# EAGLE design quantum_PSU_V2_3 (EAGLE 9.6.2)
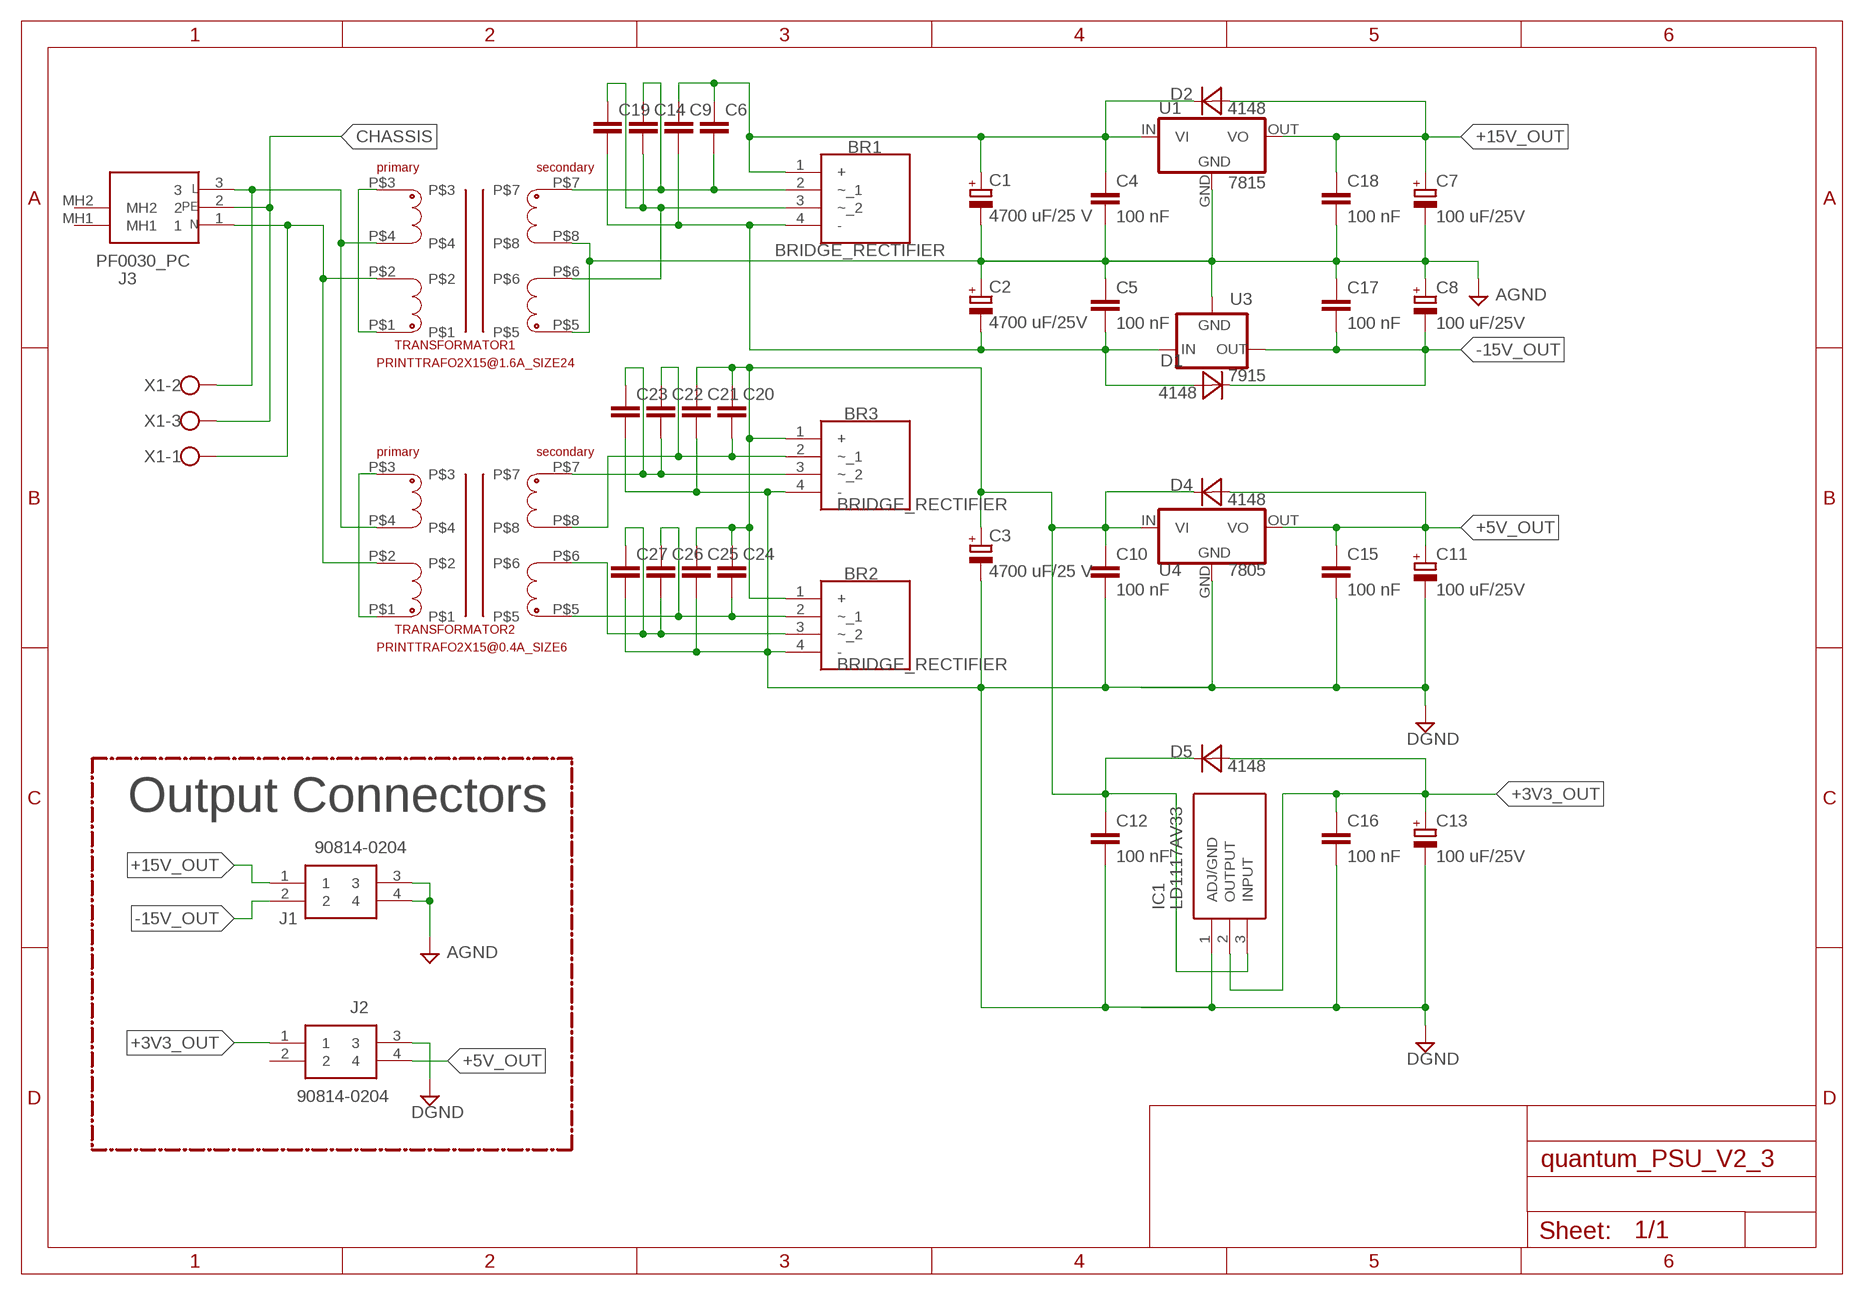
[diagram p0: schematic, sheet 1]

## Parts
BR1  BRIDGE_RECTIFIER  [KBP308G]
BR2  BRIDGE_RECTIFIER  [KBP308G]
BR3  BRIDGE_RECTIFIER  [KBP308G]
C1  4700 uF/25 V  CAPACITOR_ELECTROLYTIC_16MM-THT  [ELECTROLYTIC_16MM]
C2  4700 uF/25V  CAPACITOR_ELECTROLYTIC_16MM-THT  [ELECTROLYTIC_16MM]
C3  4700 uF/25 V  CAPACITOR_ELECTROLYTIC_16MM-THT  [ELECTROLYTIC_16MM]
C4  100 nF  CAPACITOR_5MM  [C5MM]
C5  100 nF  CAPACITOR_5MM  [C5MM]
C6  CAPACITOR_2.5MM  [C2.5MM]
C7  100 uF/25V  CAPACITOR_ELECTROLYTIC_8MM-THT  [ELECTROLYTIC_8MM]
C8  100 uF/25V  CAPACITOR_ELECTROLYTIC_8MM-THT  [ELECTROLYTIC_8MM]
C9  CAPACITOR_2.5MM  [C2.5MM]
C10  100 nF  CAPACITOR_5MM  [C5MM]
C11  100 uF/25V  CAPACITOR_ELECTROLYTIC_8MM-THT  [ELECTROLYTIC_8MM]
C12  100 nF  CAPACITOR_5MM  [C5MM]
C13  100 uF/25V  CAPACITOR_ELECTROLYTIC_8MM-THT  [ELECTROLYTIC_8MM]
C14  CAPACITOR_2.5MM  [C2.5MM]
C15  100 nF  CAPACITOR_5MM  [C5MM]
C16  100 nF  CAPACITOR_5MM  [C5MM]
C17  100 nF  CAPACITOR_5MM  [C5MM]
C18  100 nF  CAPACITOR_5MM  [C5MM]
C19  CAPACITOR_2.5MM  [C2.5MM]
C20  CAPACITOR_2.5MM  [C2.5MM]
C21  CAPACITOR_2.5MM  [C2.5MM]
C22  CAPACITOR_2.5MM  [C2.5MM]
C23  CAPACITOR_2.5MM  [C2.5MM]
C24  CAPACITOR_2.5MM  [C2.5MM]
C25  CAPACITOR_2.5MM  [C2.5MM]
C26  CAPACITOR_2.5MM  [C2.5MM]
C27  CAPACITOR_2.5MM  [C2.5MM]
D1  4148  DIODE_4148_THT  [DIODE_THT_STANDING]
D2  4148  DIODE_4148_THT  [DIODE_THT_STANDING]
D4  4148  DIODE_4148_THT  [DIODE_THT_STANDING]
D5  4148  DIODE_4148_THT  [DIODE_THT_STANDING]
IC1  LD1117AV33  [TO255P460X1020X2008-3P]
J1  90814-0204  [MOLEX_90814-0204]
J2  90814-0204  [MOLEX_90814-0204]
J3  PF0030_PC  [PF0030PC]
TRANSFORMATOR1  PRINTTRAFO2X15@1.6A_SIZE24  [LP_SIZE_24]
TRANSFORMATOR2  PRINTTRAFO2X15@0.4A_SIZE6  [LP_SIZE_6]
U1  7815  78_THT  [78XXS_]
U3  7915  79_THT  [79XXS]
U4  7805  78_THT  [78XXS_]
X1  CONNECTOR_3POL  [W237-103]

## Nets
+3V3_OUT: C13.+ C16.1 D5.A IC1.2(OUTPUT) J2.1
+5V_OUT: C11.+ C15.1 D4.A J2.4 U4.OUT(VO)
+15V_OUT: C7.+ C18.1 D2.A J1.1 U1.OUT(VO)
-15V_OUT: C8.- C17.2 D1.C J1.2 U3.OUT
AGND: C1.- C2.+ C4.2 C5.1 C7.- C8.+ C17.1 C18.2 J1.3 J1.4 TRANSFORMATOR1.P$5 TRANSFORMATOR1.P$8 U1.GND U3.GND
CHASSIS: J3.2 X1.3
DGND: BR2.4(-) BR3.4(-) C3.- C10.2 C11.- C12.2 C13.- C15.2 C16.2 C21.2 C23.2 C25.2 C27.2 IC1.1(ADJ/GND) J2.3 U4.GND
N$1: BR3.3(~_2) C22.2 C23.1 TRANSFORMATOR2.P$7
N$2: TRANSFORMATOR2.P$1 TRANSFORMATOR2.P$3
N$3: BR1.3(~_2) C14.2 C19.1 TRANSFORMATOR1.P$6
N$4: TRANSFORMATOR1.P$1 TRANSFORMATOR1.P$3
N$6: BR3.2(~_1) C20.2 C22.1 TRANSFORMATOR2.P$8
N$7: BR2.3(~_2) C26.2 C27.1 TRANSFORMATOR2.P$6
N$8: J3.3 TRANSFORMATOR1.P$4 TRANSFORMATOR2.P$4 X1.2
N$9: J3.1 TRANSFORMATOR1.P$2 TRANSFORMATOR2.P$2 X1.1
N$10: BR2.1(+) BR3.1(+) C3.+ C10.1 C12.1 C20.1 C21.1 C24.1 C25.1 D4.C D5.C IC1.3(INPUT) U4.IN(VI)
N$11: BR1.2(~_1) C6.2 C14.1 TRANSFORMATOR1.P$7
N$12: BR2.2(~_1) C24.2 C26.1 TRANSFORMATOR2.P$5
N$15: BR1.1(+) C1.+ C4.1 C6.1 C9.1 D2.C U1.IN(VI)
N$17: BR1.4(-) C2.- C5.2 C9.2 C19.2 D1.A U3.IN
Unconnected: J2.2 J3.MH1 J3.MH2

## Notes on the sheet
- Output Connectors

## Library data of the parts
BR1-BR3 = passive components:BRIDGE_RECTIFIER: Bridge Rectifiers Bridge Rectifier KBP Source: Datasheet <https://componentsearchengine.com/Datasheets/1/KBP308G.pdf>; DESCRIPTION: Bridge Rectifiers Bridge Rectifier KBP; HEIGHT: 3mm; MANUFACTURER_NAME: Diodes Inc.; MANUFACTURER_PART_NUMBER: KBP308G; MOUSER_PART_NUMBER: 621-KBP308G; MOUSER_PRICE-STOCK: https://www.mouser.com/Search/Refine.aspx?Keyword=621-KBP308G
C1-C3 C7 C8 C11 C13 = passive components:CAPACITOR_ELECTROLYTIC: Electrolytic Capacitor SMD
C4-C6 C9 C10 C12 C14-C27 = passive components:CAPACITOR: ceramic capacitor
D1 D2 D4 D5 = passive components:DIODE: Standard 4148 Diode SOD323 Format; MOUSER_PART_NUMBER: ...
IC1 = passive components:LD1117AV33: LD1117AV33, Low Dropout Voltage Regulator, 1.2A, 3.3 V +/-2%, 3-Pin TO-220 Source: Datasheet <http://www.st.com/web/en/resource/technical/document/datasheet/CD00002116.pdf>; DESCRIPTION: LD1117AV33, Low Dropout Voltage Regulator, 1.2A, 3.3 V +/-2%, 3-Pin TO-220; HEIGHT: 4.6mm; MANUFACTURER_NAME: STMicroelectronics; MANUFACTURER_PART_NUMBER: LD1117AV33; MOUSER_PART_NUMBER: 511-LD1117AV33; MOUSER_PRICE-STOCK: https://www.mouser.co.uk/ProductDetail/STMicroelectronics/LD1117AV33?qs=hUhhBvpTJN9Rfx8G8TXH1A%3D%3D
J1 J2 = electro_mechanical:90814-0204: CONN HEADER 4POS 1.27MM SMD TIN Source: Datasheet <https://componentsearchengine.com/Datasheets/1/90814-0204.pdf>; DESCRIPTION: CONN HEADER 4POS 1.27MM SMD TIN; HEIGHT: mm; MANUFACTURER_NAME: Molex; MANUFACTURER_PART_NUMBER: 90814-0204; MOUSER_PART_NUMBER: 538-90814-0204; MOUSER_PRICE-STOCK: https://www.mouser.com/Search/Refine.aspx?Keyword=538-90814-0204
J3 = electro_mechanical:PF0030_PC: Bulgin C14 Right Angle Through Hole IEC Plug Male, 10A, 250 V ac Source: Datasheet <https://componentsearchengine.com/Datasheets/1/PF0030_PC.pdf>; DESCRIPTION: Bulgin C14 Right Angle Through Hole IEC Plug Male, 10A, 250 V ac; HEIGHT: 35.8mm; MANUFACTURER_NAME: Bulgin; MANUFACTURER_PART_NUMBER: PF0030/PC; MOUSER_PART_NUMBER: 161-PF0030/PC; MOUSER_PRICE-STOCK: https://www.mouser.com/Search/Refine.aspx?Keyword=161-PF0030%2FPC
TRANSFORMATOR1 = passive components:PRINTTRAFO: Printtrafo several siyes availlable; MOUSER_PART_NUMBER: 530-LP-30-800
TRANSFORMATOR2 = passive components:PRINTTRAFO: Printtrafo several siyes availlable; MOUSER_PART_NUMBER: 530-LP-30-200
U1 U4 = passive components:78**
U3 = passive components:79**: VOLTAGE REGULATOR
X1 = electro_mechanical:CONNECTOR: WAGO SCREW CLAMP

## Board
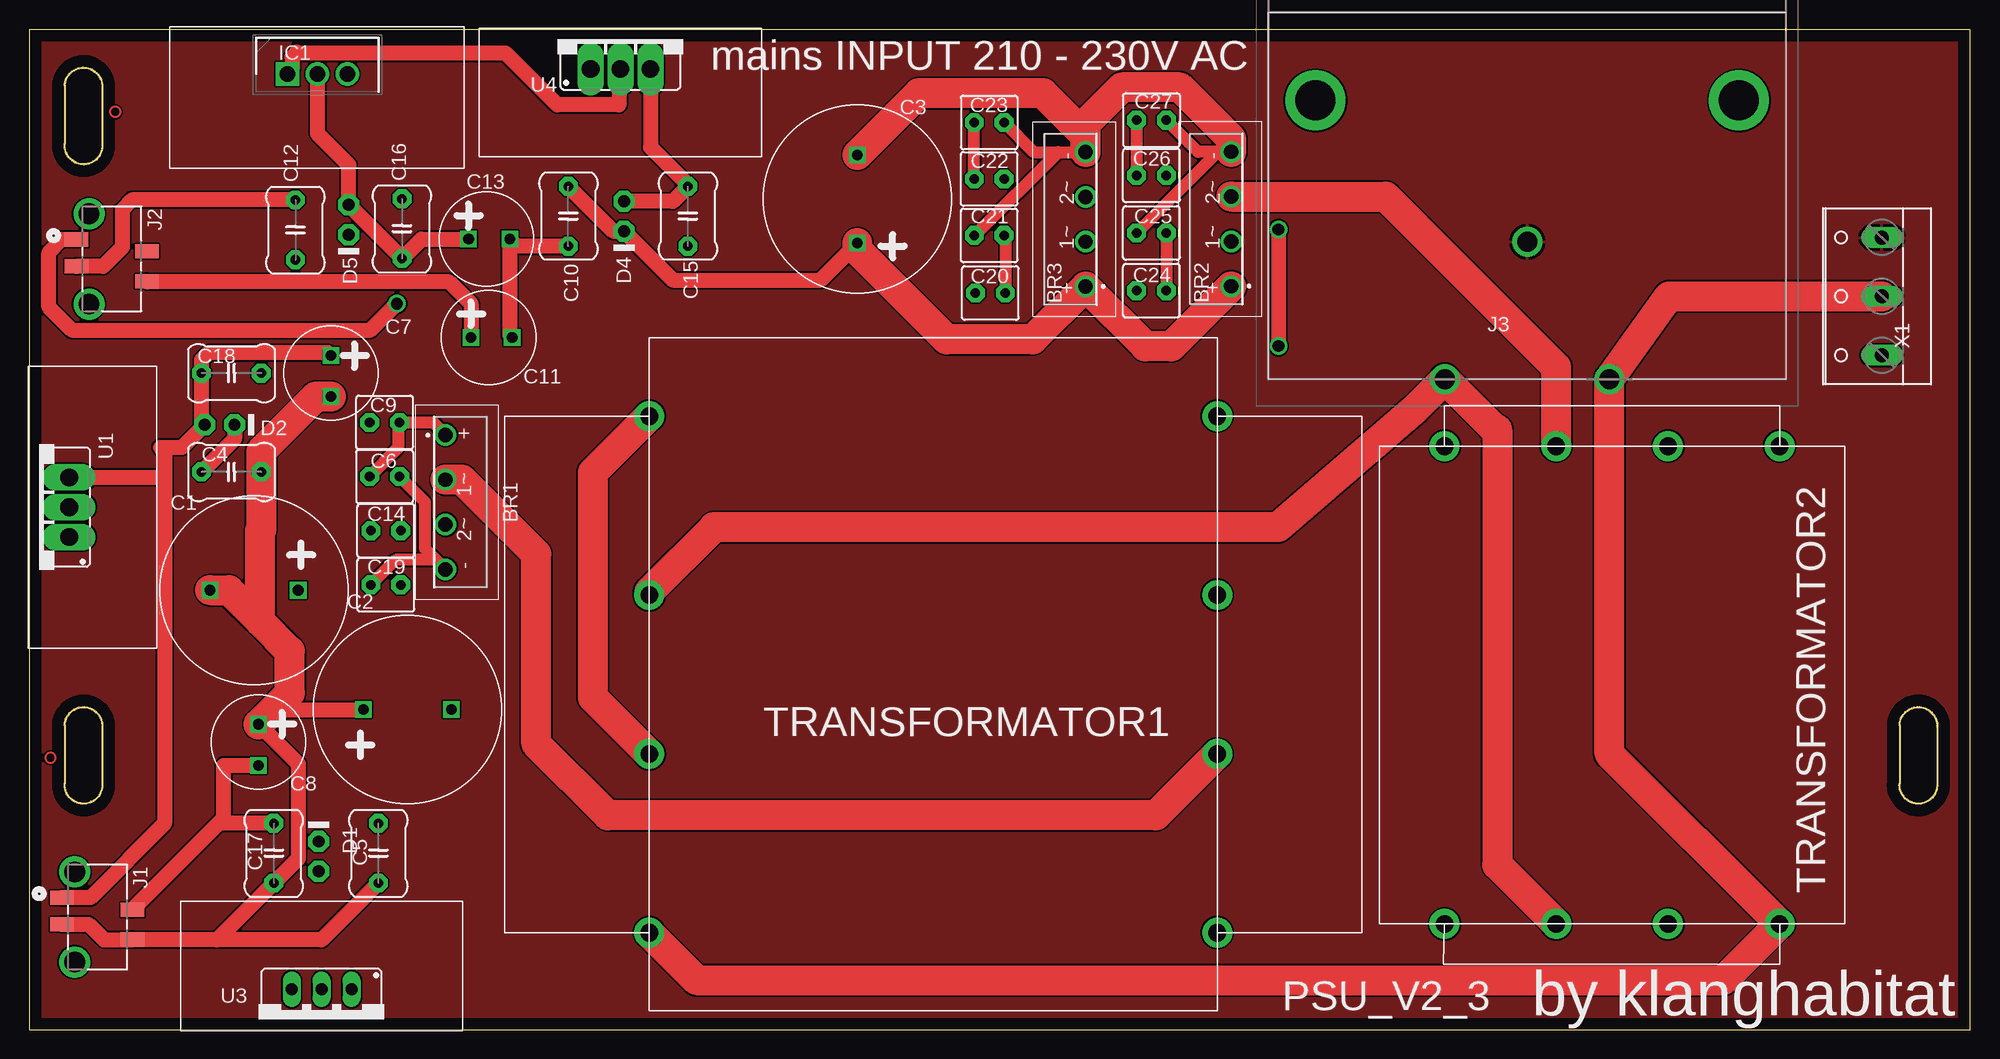
[diagram p1: board, top side]
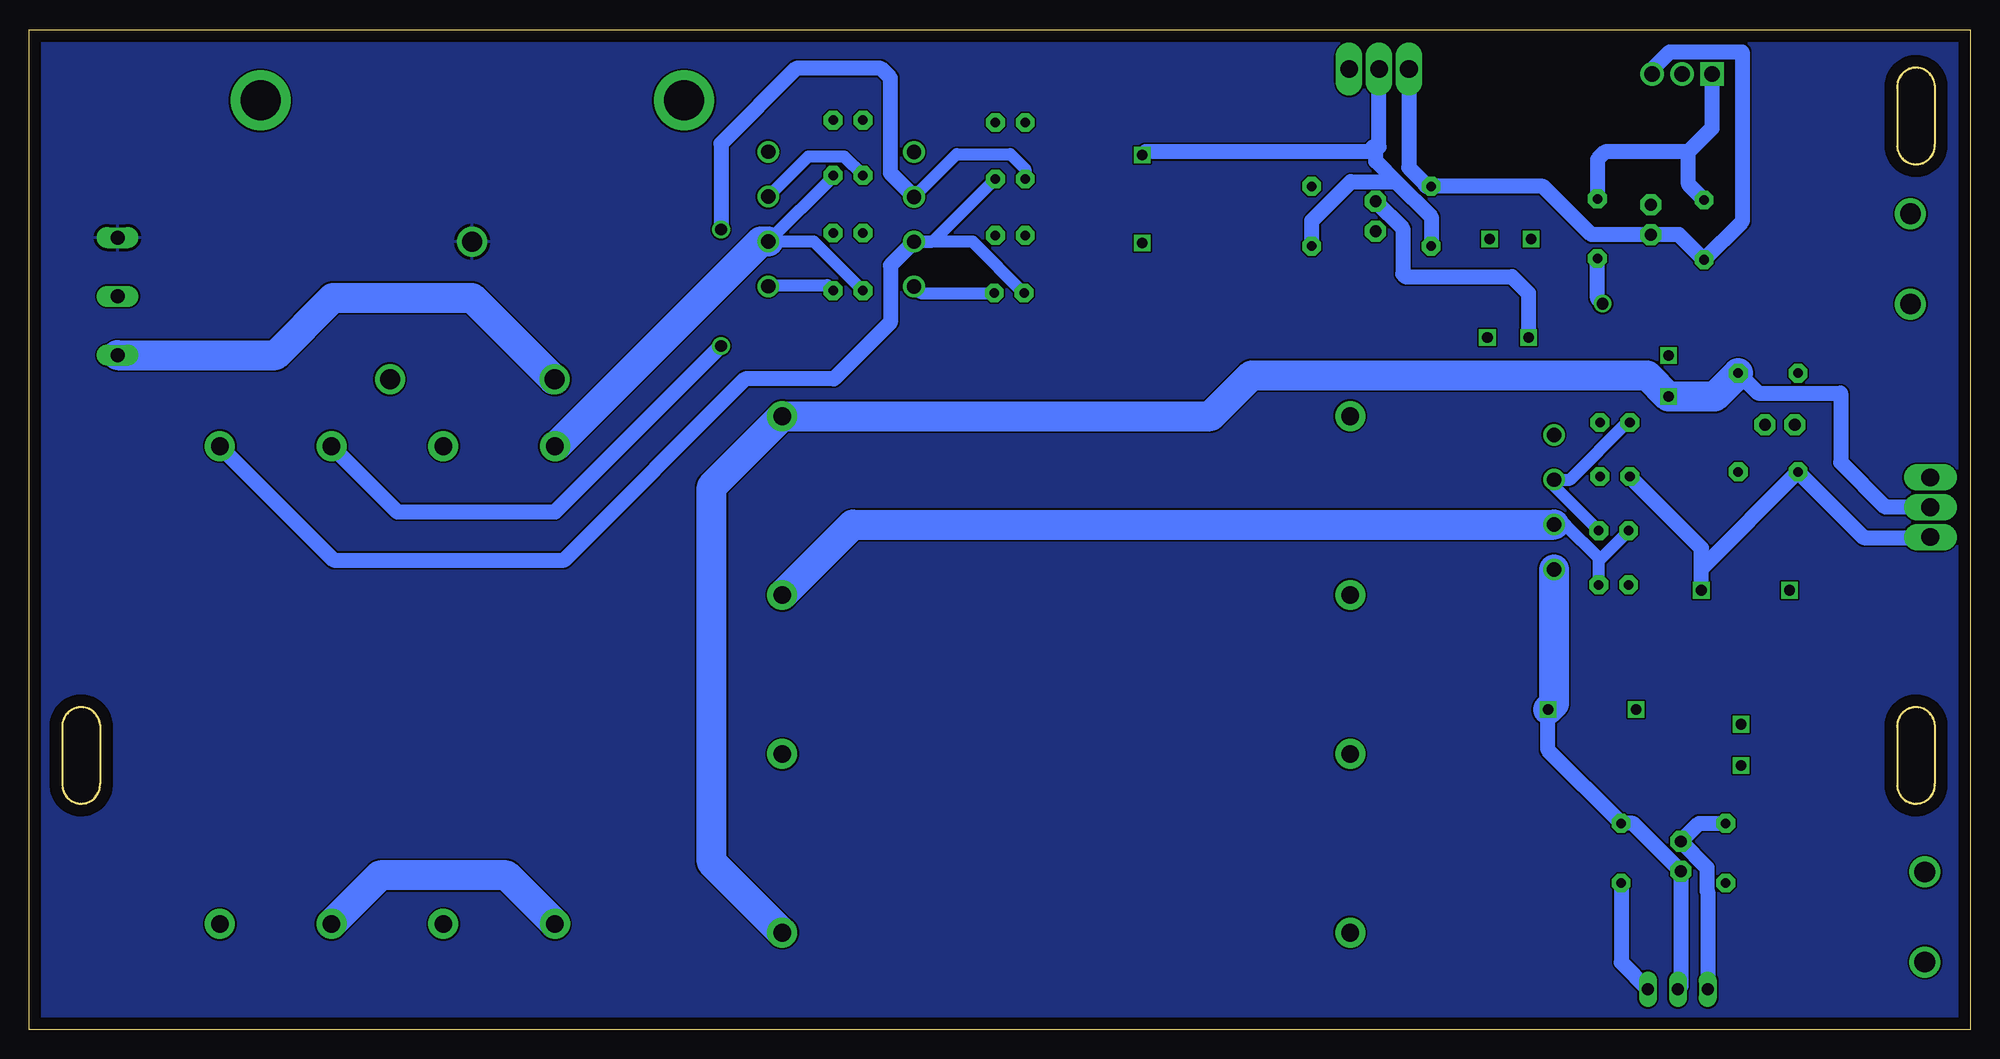
[diagram p2: board, bottom side, seen from below]

Size 165 x 85 mm. Coordinates in mm from the lower left corner, seen from the top.
Outline: 0,0 165,0 165,85 0,85 0,0
Outline: 3,80.25 arc-180 6.2,80.05 6.2,75.05 arc-180 3,75.25 3,80.25
Outline: 3,25.9 arc-180 6.2,25.7 6.2,20.7 arc-180 3,20.9 3,25.9
Outline: 159,25.9 arc-180 162.2,25.7 162.2,20.7 arc-180 159,20.9 159,25.9
Copper layers (1*16): Top 0.035mm / dielectric 1.5mm / Bottom 0.035mm
Design rules "default *": minimum track width 6mil, minimum drill 0.35mm, track to track 6mil, track to pad 6mil, pad to pad 6mil, via to via 6mil, smd to smd 6mil, copper to edge 40mil, drill to drill 6mil, minimum pad ring 10mil, minimum via ring 8mil, stop-mask expansion 4mil, vias tented up to drill 0mil, thermal gap 10mil

### Footprints (pad centres in the part's own frame; a part is rotated, then mirrored left to right if it is on the bottom)
KBP308G = drill 1.22 pad 1.83: 1 -5.715,-0.95; 2 -1.905,-0.95; 3 1.905,-0.95; 4 5.715,-0.95
ELECTROLYTIC_16MM = drill 0.9 square: + -3.75,0; - 3.75,0
C5MM = drill 0.813 pad 1.6 octagon: 1 -1.27,0; 2 3.81,0
C2.5MM = drill 0.813 pad 1.6 octagon: 1 -1.27,0; 2 1.27,0
ELECTROLYTIC_8MM = drill 0.9 square: + -1.5,0; - 2,0
DIODE_THT_STANDING = drill 1 pad 1.778 octagon: A 0,0; C -2.54,0
TO255P460X1020X2008-3P = drill 1.32 pad 1.98 square: 1 0,0 | drill 1.32 pad 1.98: 2 2.55,0; 3 5.1,0
MOLEX_90814-0204 = smd 1.194 x 2.007: 1 0.254,0; 2 1.27,5.994; 3 2.54,0; 4 3.81,5.994 | drill 1.753 pad 2.629: 5 -1.93,1.092; 6 5.74,1.092
PF0030PC = drill 1.7 pad 2.55: 1 0,0; 2 7,11.7; 3 14,0 | drill 3.4 pad 5.1: MH1 -11,23.7; MH2 25,23.7
LP_SIZE_24 = drill 1.5 pad 2.54: P$1 12.3,50.55; P$2 12.3,35.35; P$3 12.3,21.85; P$4 12.3,6.65; P$5 60.6,50.55; P$6 60.6,35.35; P$7 60.6,21.85; P$8 60.6,6.65
LP_SIZE_6 = drill 1.5 pad 2.54: P$1 3.45,34.05; P$2 3.45,24.55; P$3 3.45,15.05; P$4 3.45,5.55; P$5 44.05,34.05; P$6 44.05,24.55; P$7 44.05,15.05; P$8 44.05,5.55
78XXS_ = drill 1.499 pad 1.93 long: GND 0,-2.54; IN -2.54,-2.54; OUT 2.54,-2.54
79XXS = drill 1.016 long: GND -2.54,-2.54; IN 0,-2.54; OUT 2.54,-2.54
W237-103 = drill 1.194 long: 1 -5,-1.29; 2 0,-1.29; 3 5,-1.29

### Placement (x,y rotation side)
BR1  36.33,44.83 270 top
BR2  101.24,68.89 90 top
BR3  88.84,68.87 90 top
C1  19.1,37.34 180 top
C2  32.14,27.2 0 top
C3  70.39,70.59 90 top
C4  15.9,47.4 0 top
C5  29.67,13.72 90 top
C6  30.2,51.6 180 top
C7  25.65,55.79 270 top
C8  19.48,24.45 270 top
C9  30.2,47 0 top
C10  45.82,70.4 270 top
C11  39.04,58.83 0 top
C12  22.62,66.7 90 top
C13  38.84,67.19 0 top
C14  30.3,42.4 180 top
C15  55.98,70.4 270 top
C16  31.68,66.8 90 top
C17  20.78,13.72 90 top
C18  15.9,55.79 0 top
C19  30.3,37.8 180 top
C20  81.7,62.6 180 top
C21  81.6,67.5 180 top
C22  81.6,72.3 180 top
C23  81.6,77.1 0 top
C24  95.4,62.8 180 top
C25  95.4,67.7 180 top
C26  95.4,72.6 180 top
C27  95.4,77.3 0 top
D1  24.59,13.45 270 top
D2  14.9,51.4 180 top
D4  50.55,70.4 90 top
D5  27.15,70.1 90 top
IC1  21.94,81.22 0 top
J1  2.76,11.47 270 top
J2  3.99,67.41 270 top
J3  120.34,55.27 0 top
TRANSFORMATOR1  40.4,1.58 0 top
TRANSFORMATOR2  154.36,5.53 90 top
U1  0.84,44.4 90 top
U3  24.85,0.89 180 top
U4  50.26,84.18 0 top
X1  156.21,62.32 90 top

### Tracks (layer width: path | path; a pad name or v marks a point on that pad's centre or on a via)
+3V3_OUT  (via drill 1)
  Top 1.27: C13.+ 33.34,67.19 C16.1 31.68,65.57 D5.A 27.15,73.49 24.49,76.15 IC1.2 | v31.24,61.7 28.99,59.45 3.62,59.45 1.65,61.41 1.65,66.04 2.76,67.15 J2.1
  Bottom 1.27: v31.24,61.7 31.68,62.14 C16.1
+5V_OUT
  Top 1.27: U4.OUT 52.8,74.97 55.98,71.79 C15.1 54.71,70.4 D4.A | J2.4 10.02,63.55 35.69,63.55 37.54,61.7 C11.+
  Bottom 1.27: D4.A 48.24,68.09 48.24,64.2 48.04,64 38.94,64 37.54,62.6 C11.+
+15V_OUT
  Top 1.27: 11.5,46.94 11.5,49.1 11.12,49.48 12.98,49.48 D2.A 14.63,51.67 C18.1 14.63,56.91 15.26,57.54 25.39,57.54 C7.+ | 11.5,46.94 11.5,17.52 5.2,11.22 J1.1 | U1.OUT 11.5,46.94
-15V_OUT
  Top 1.27: J1.2 16.08,17.53 | 16.08,17.53 16.51,17.96 16.51,22.45 C8.- | C17.2 16.08,17.53
  Bottom 1.27: C17.2 23.05,17.53 D1.C 22.37,13.77 22.37,11.79 22.31,11.73 U3.OUT
AGND
  Top 1.27: J1.3 5.04,8.93 6.35,7.62 8.71,7.62 | 8.71,7.62 J1.4 | 15.95,7.62 C17.1 22.86,14.53 22.86,22.57 C8.+ 20.73,27.2 C2.+ | 15.95,7.62 8.71,7.62 | C5.1 24.84,7.62 15.95,7.62
  Top 2.54: 19.6,34.7 19.6,42.4 19.71,42.51 C4.2 19.71,49.16 24.34,53.79 C7.- | C1.- 16.96,37.34 19.6,34.7 | 19.6,34.7 22.14,32.16 22.14,28.59 C8.+
  Bottom 1.27: U1.GND 7.19,44.4 11,48.21 11,54.09 18.01,54.09 C18.2 | C5.1 29.67,5.71 U3.GND
  Bottom 2.54: TRANSFORMATOR1.P$8 107,14.23 107,46.13 TRANSFORMATOR1.P$5 64.57,52.13 61.1,55.6 27.46,55.6 C7.- 21.71,53.79 C18.2
CHASSIS
  pour Bottom: -2.54,88.4 -2.54,-2.54 171.52,-2.54 171.52,88.4
  pour Top: -3.8,89 -3.8,-3.7 172.4,-3.7 172.4,89
DGND
  Top 1.016: C25.2 101.03,74.61 BR2.4 99.36,74.61 C27.2 | C23.2 85.39,74.58 BR3.4 87.49,74.58 80.41,67.5 C21.2
  Top 1.27: C11.- 40.84,59.02 C13.- 41.44,66.59 C10.2 | IC1.1 22.32,81.61 22.32,82.68 22.74,83.1 22.84,83 40.48,83 44.88,78.6 50.13,78.6 50.13,81.52 U4.GND | J2.3 6.26,64.87 7.9,66.51 7.9,69.7 8.71,70.51 C12.2
  Top 2.54: BR2.4 102.19,75.7 97.81,80.08 92.89,80.08 89.79,76.98 BR3.4 89.79,75.98 86.19,79.58 75.64,79.58 C3.-
  Bottom 1.27: C10.2 45.82,69.08 48.81,72.07 | 48.81,72.07 50.53,73.79 50.53,74.62 50.78,74.62 | C15.2 55.98,68.76 52.66,72.08 49.86,72.08 49.85,72.07 48.81,72.07 | 50.78,74.62 70.11,74.62 C3.- | IC1.1 21.94,76.6 23.94,74.6 | 23.94,74.6 23.94,71.83 C12.2 | 23.94,74.6 31.04,74.6 31.68,73.96 C16.2 | 50.78,74.62 50.78,75 50.26,75 U4.GND
N$1  (via drill 1)
  Top 1.016: C22.2 C23.1
  Top 1.27: v106.2,68 v106.2,58.1
  Bottom 1.016: BR3.3 86.17,74.4 81.6,74.4 80.33,73.13 C22.2
  Bottom 1.27: TRANSFORMATOR2.P$7 133.73,44 120.3,44 v106.2,58.1 | BR3.3 91.8,72.78 91.8,80.9 92.6,81.7 99.8,81.7 106.2,75.3 v106.2,68
N$2
  Bottom 2.54: TRANSFORMATOR2.P$1 124.43,13.1 135.19,13.1 TRANSFORMATOR2.P$3
N$3
  Bottom 1.016: BR1.3 34.4,42.92 31.57,40.1 C19.1 31.57,39.86 C14.2
  Bottom 2.54: TRANSFORMATOR1.P$6 95,42.92 BR1.3
N$4
  Top 2.54: TRANSFORMATOR1.P$1 47.9,47.33 47.9,28.23 TRANSFORMATOR1.P$3
N$6
  Bottom 1.016: C20.2 84.8,66.97 BR3.2 88.2,66.97 C22.1
  Bottom 1.27: TRANSFORMATOR2.P$8 139.13,39.9 119.54,39.9 104.14,55.3 96.6,55.3 91.8,60.1 91.8,64.95 BR3.2
N$7
  Top 1.016: C27.1 C26.2
  Top 2.54: BR2.3 115.31,70.8 129.81,56.3 TRANSFORMATOR2.P$6
  Bottom 1.016: C26.2 95.73,74.2 98.78,74.2 BR2.3
N$8
  Top 2.54: X1.2 139.39,62.32 J3.3 134.34,23.45 TRANSFORMATOR2.P$4 144.03,4.2 56.73,4.2 TRANSFORMATOR1.P$4
N$9
  Top 2.54: TRANSFORMATOR2.P$2 124.8,13.99 124.8,51 124.39,51.23 J3.1 117.86,52.78 106.17,42.7 58.2,42.7 52.7,37.2 TRANSFORMATOR1.P$2
  Bottom 2.54: X1.1 144.08,57.32 139.2,62.2 127.37,62.2 120.44,55.27 J3.1
N$10
  Top 1.016: C25.1 C24.1 | C21.1 82.97,67.4 C20.1
  Top 1.27: C10.1 49.63,67.86 D4.C 54.71,63.7 67.25,63.7 C3.+
  Top 2.54: BR2.1 97.09,58.08 94.87,58.08 BR3.1 85.29,58.66 77.97,58.66 70.39,66.24 C3.+
  Bottom 1.016: C24.1 97.14,63.27 102.09,63.27 BR2.1 | BR3.1 89.23,62.6 C20.1
  Bottom 1.27: U4.IN 47.72,73.26 46.37,71.91 46.37,71.82 46.22,71.67 C10.1 36.31,71.67 32.2,67.56 D5.C 24.75,67.56 C12.1 19.38,68.67 19.38,83.11 25.53,83.11 27.04,81.6 IC1.3
N$11
  Top 2.54: TRANSFORMATOR1.P$7 95.77,18.2 49.2,18.2 43.1,24.3 43.1,40.42 36.78,46.73 BR1.2
  Bottom 0.406: 35.38,46.21 BR1.2
  Bottom 1.016: C14.1 35.38,46.21 | BR1.2 33.99,46.73 29.13,51.6 C6.2
N$12
  Bottom 1.016: C24.2 98.31,66.98 BR2.2 96.67,72.5 C26.1
  Bottom 2.54: TRANSFORMATOR2.P$5 120.22,49.58 102.81,66.98 BR2.2
N$15
  Top 1.016: C9.1 31.37,49.44 31.37,51.5 C6.1 34.33,51.6 BR1.1
  Top 1.27: D2.C 17.44,50.21 C4.1
  Bottom 1.27: U1.IN 3.43,41.81 9.04,41.81 C4.1 22.85,39.18 | C1.+ 22.85,39.18 | 22.85,39.18 22.85,40.92 C9.1
N$17
  Top 0.406: 35.38,39.13 BR1.4
  Top 1.016: BR1.4 34.58,39.91 31.14,39.91 C19.2 | C9.2 33.61,44.86 33.61,40.9 35.38,39.13
  Bottom 1.27: U3.IN 24.59,3.68 D1.A 28.67,17.53 C5.2 35.89,23.75 C2.-
  Bottom 2.54: C2.- 35.38,27.71 BR1.4
(copper drawn outside any net)
  shapes: Top circle x2

### Text on the board
tNames: mains INPUT 210 - 230V AC | PSU_V2_3 | by klanghabitat